# Altium schematic sheet Relays.SchDoc
size A3
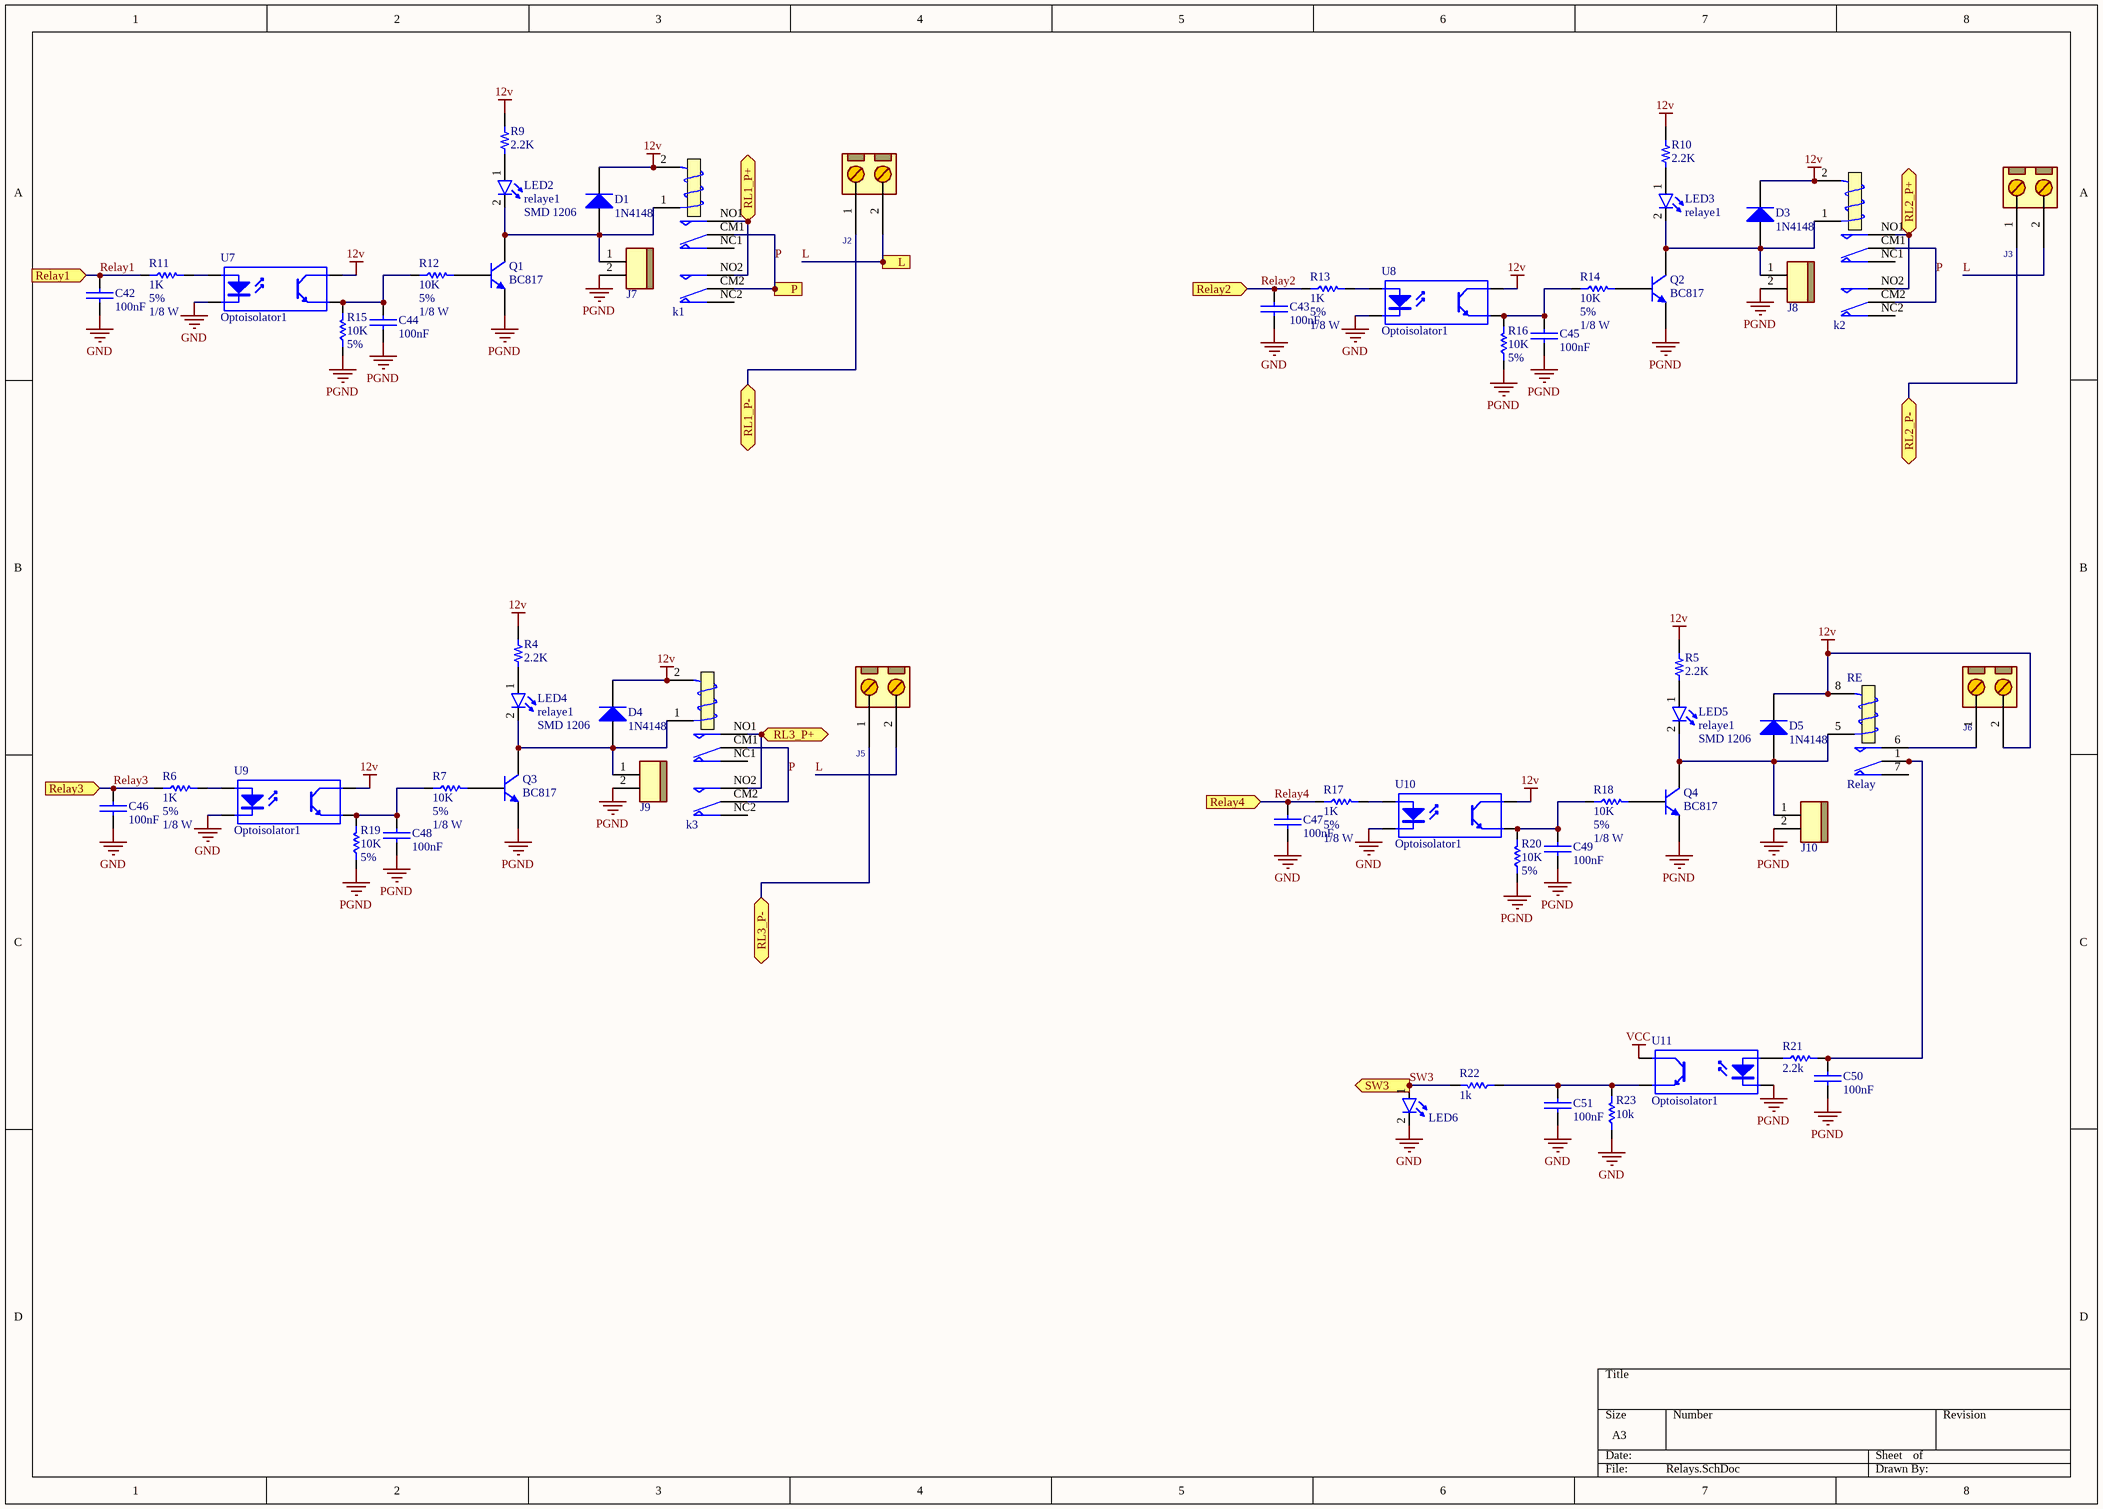
[diagram p0: Relays.SchDoc]

## Parts
C42  100nF  [CAP 0805_2012]
C43  100nF  [CAP 0805_2012]
C44  100nF  [CAP 0805_2012]
C45  100nF  [CAP 0805_2012]
C46  100nF  [CAP 0805_2012]
C47  100nF  [CAP 0805_2012]
C48  100nF  [CAP 0805_2012]
C49  100nF  [CAP 0805_2012]
C50  100nF  [CAP 0805_2012]
C51  100nF  [CAP 0805_2012]
D1  1N4148  [LL4148]
D3  1N4148  [LL4148]
D4  1N4148  [LL4148]
D5  1N4148  [LL4148]
J2  CONN_TB2  [P_TBB_2]  (value not drawn)
J3  CONN_TB2  [P_TBB_2]  (value not drawn)
J5  CONN_TB2  [P_TBB_2]  (value not drawn)
J6  CONN_TB2  [P_TBB_2]  (value not drawn)
J7  JST BxB-PH-K 2Pin  [JST B2B-PH-K]  (value not drawn)
J8  JST BxB-PH-K 2Pin  [JST B2B-PH-K]  (value not drawn)
J9  JST BxB-PH-K 2Pin  [JST B2B-PH-K]  (value not drawn)
J10  JST BxB-PH-K 2Pin  [JST B2B-PH-K]  (value not drawn)
k1  Relay_8PIN_OMRON  [Relay_8]  (value not drawn)
k2  Relay_8PIN_OMRON  [Relay_8]  (value not drawn)
k3  Relay_8PIN_OMRON  [Relay_8]  (value not drawn)
LED2  power: relaye1  Size: SMD 1206  [LED SMD 1206]
LED3  power: relaye1  [LED SMD 1206]
LED4  power: relaye1  Size: SMD 1206  [LED SMD 1206]
LED5  power: relaye1  Size: SMD 1206  [LED SMD 1206]
LED6  (no value)  [LED_1206_GREEN]
Q1  BC817  [SOT23_BEC_M]
Q2  BC817  [SOT23_BEC_M]
Q3  BC817  [SOT23_BEC_M]
Q4  BC817  [SOT23_BEC_M]
R4  2.2K  [RES 0805_2012]
R5  2.2K  [RES 0805_2012]
R6  Tolerance: 5%  Power: 1/8 W  [RES 0805_2012]  (hidden comment: 1K)
R7  Tolerance: 5%  Power: 1/8 W  [RES 0805_2012]  (hidden comment: 10K)
R9  2.2K  [RES 0805_2012]
R10  2.2K  [RES 0805_2012]
R11  Tolerance: 5%  Power: 1/8 W  [RES 0805_2012]  (hidden comment: 1K)
R12  Tolerance: 5%  Power: 1/8 W  [RES 0805_2012]  (hidden comment: 10K)
R13  Tolerance: 5%  Power: 1/8 W  [RES 0805_2012]  (hidden comment: 1K)
R14  Tolerance: 5%  Power: 1/8 W  [RES 0805_2012]  (hidden comment: 10K)
R15  Tolerance: 5%  [RES 0805_2012]  (hidden comment: 10K)
R16  Tolerance: 5%  [RES 0805_2012]  (hidden comment: 10K)
R17  Tolerance: 5%  Power: 1/8 W  [RES 0805_2012]  (hidden comment: 1K)
R18  Tolerance: 5%  Power: 1/8 W  [RES 0805_2012]  (hidden comment: 10K)
R19  Tolerance: 5%  [RES 0805_2012]  (hidden comment: 10K)
R20  Tolerance: 5%  [RES 0805_2012]  (hidden comment: 10K)
R21  2.2k  [RES 0805_2012]
R22  1k  [RES 0805_2012]
R23  10k  [RES 0805_2012]
RE  Relay  [Through-hole 6PIN]
U7  Optoisolator1  [DIP-4]
U8  Optoisolator1  [DIP-4]
U9  Optoisolator1  [DIP-4]
U10  Optoisolator1  [DIP-4]
U11  Optoisolator1  [DIP-4]

## Ports
L (in), P (in), Relay1 (in), Relay2 (in), Relay3 (in), Relay4 (in), RL1_P+ (bidir), RL1_P- (bidir), RL2_P+ (bidir), RL2_P- (bidir), RL3_P+ (bidir), RL3_P- (bidir), SW3 (out)

## Nets
12v: D1.2(K) D3.2(K) D4.2(K) D5.2(K) J6.2 k1.2(T2) k2.2(T2) k3.2(T2) R4.2 R5.2 R9.2 R10.2 RE.8(T2) U7.4(C) U8.4(C) U9.4(C) U10.4(C)
GND: C42.1(+) C43.1(+) C46.1(+) C47.1(+) C51.1(+) LED6.2(K) R23.1 U7.2(K) U8.2(K) U9.2(K) U10.2(K)
PGND: C44.1(+) C45.1(+) C48.1(+) C49.1(+) C50.1(+) J7.2 J8.2 J9.2 J10.2 Q1.2(E) Q2.2(E) Q3.2(E) Q4.2(E) R15.1 R16.1 R19.1 R20.1 U11.2(K)
VCC: U11.4(C)
L: J2.2 J3.2 J5.2 ; port L
P: k1.CM1(COM) k1.CM2(COM) k2.CM1(COM) k2.CM2(COM) k3.CM1(COM) k3.CM2(COM) ; port P
Relay1: C42.2(-) R11.1 ; port Relay1
Relay2: C43.2(-) R13.1 ; port Relay2
Relay3: C46.2(-) R6.1 ; port Relay3
Relay4: C47.2(-) R17.1 ; port Relay4
RL1_P+: k1.NO1(NO) k1.NO2(NO) ; port RL1_P+
RL1_P-: J2.1 ; port RL1_P-
RL2_P+: k2.NO1(NO) k2.NO2(NO) ; port RL2_P+
RL2_P-: J3.1 ; port RL2_P-
RL3_P+: k3.NO1(NO) k3.NO2(NO) ; port RL3_P+
RL3_P-: J5.1 ; port RL3_P-
SW3: LED6.1(A) R22.2 ; port SW3
NetC44_2: C44.2(-) R12.1 R15.2 U7.3(E)
NetC45_2: C45.2(-) R14.1 R16.2 U8.3(E)
NetC48_2: C48.2(-) R7.1 R19.2 U9.3(E)
NetC49_2: C49.2(-) R18.1 R20.2 U10.3(E)
NetC50_2: C50.2(-) R21.2 RE.1(COM) RE.12(COM)
NetC51_2: C51.2(-) R22.1 R23.2 U11.3(E)
NetD1_1: D1.1(A) J7.1 k1.1(T1) LED2.2(K) Q1.3(C)
NetD3_1: D3.1(A) J8.1 k2.1(T1) LED3.2(K) Q2.3(C)
NetD4_1: D4.1(A) J9.1 k3.1(T1) LED4.2(K) Q3.3(C)
NetD5_1: D5.1(A) J10.1 LED5.2(K) Q4.3(C) RE.5(T1)
NetJ6_1: J6.1 RE.6(NO)
NetLED2_1: LED2.1(A) R9.1
NetLED3_1: LED3.1(A) R10.1
NetLED4_1: LED4.1(A) R4.1
NetLED5_1: LED5.1(A) R5.1
NetQ1_1: Q1.1(B) R12.2
NetQ2_1: Q2.1(B) R14.2
NetQ3_1: Q3.1(B) R7.2
NetQ4_1: Q4.1(B) R18.2
NetR6_2: R6.2 U9.1(A)
NetR11_2: R11.2 U7.1(A)
NetR13_2: R13.2 U8.1(A)
NetR17_2: R17.2 U10.1(A)
NetR21_1: R21.1 U11.1(A)

Not connected (* = marked no-connect by the designer): k1 NC1(NC) NC2(NC); k2 NC1(NC) NC2(NC); k3 NC1(NC) NC2(NC); RE 7(NC)

## Library data of the parts
C42-C51 = Cap-Bipolar: Bipolar Capacitor; Voltage: 100V; Designer: Saeid Jorablo; Organazation: ControTec; Adding Date: 1387/12/20; Value: 100nF
D1 D3-D5 = Diode 1N4148: High Conductance Fast Diode; Published: 8-Jun-2000; LatestRevisionDate: 17-Jul-2002; LatestRevisionNote: Re-released for DXP Platform.; DatasheetVersion: 1997; PackageReference: DO-35; Publisher: Altium Limited; PackageDescription: Diode, Axial; Body 3.8 x 1.9 mm (LxDia. max), Lead Dia. 0.53 mm (max); Code_JEDEC: DO-204-AH; ComponentLink1Description: Manufacturer Link; ComponentLink1URL: http://www.fairchildsemi.com/; ComponentLink2Description: Datasheet; ComponentLink2URL: http://www.fairchildsemi.com/ds/1N%2F1N4148.pdf
J2 J3 J5 J6 = TB2 BLUE: CONN, TERMINAL BLOCK, 5.08mm pitch; VALUE: CONN_TB2
J7-J10 = JST BxB-PH-K 2Pin: Connector Header Through Hole 0.079" (2.00mm); PartNumber: B2B-PH-K-S(LF)(SN)
LED2-LED5 = LED: Designer: Saeid Jorablo; Organazation: ControTec; Adding Date: 1387/12/22
LED6 = LED: Designer: Saeid Jorablo; Organazation: ControTec; power: relaye1; Adding Date: 1387/12/22; Size: SMD 1206
Q1-Q4 = NPN: NPN Bipolar Transistor; Published: 8-Jun-2000; LatestRevisionDate: 29-May-2009; LatestRevisionNote: IPC-7351 Footprint Added.; PackageVersion: Aug-1999; PackageReference: SOT-23B; Publisher: Altium Limited; PackageDescription: 3-Pin SOT-23 Package 0.95 mm Pitch, 2.4 mm Lead Span
R4 R5 R9 R10 = Res SMD 0805: SMD Resistor; Value: 2.2K
R6 R7 R11-R20 = Resistor
  R6 R11 R13 R17: Value: 1K
  R7 R12 R14-R16 R18-R20: Value: 10K
R21-R23 = Resistor: Tolerance: 5%; Power: 1/8 W
  R21: Value: 2.2k
  R22: Value: 1k
  R23: Value: 10k
RE = RELAY 5V 3A: pin to pad: 12>1
U7-U11 = Optoisolator1: 4-Pin Phototransistor Optocoupler; Published: 24-Mar-1999; LatestRevisionDate: 04-Mar-2005; LatestRevisionNote: Sch pins 3 & 4 Swapped.; DatasheetVersion: Nov-2003; PackageReference: DIP-4; Publisher: Altium Limited